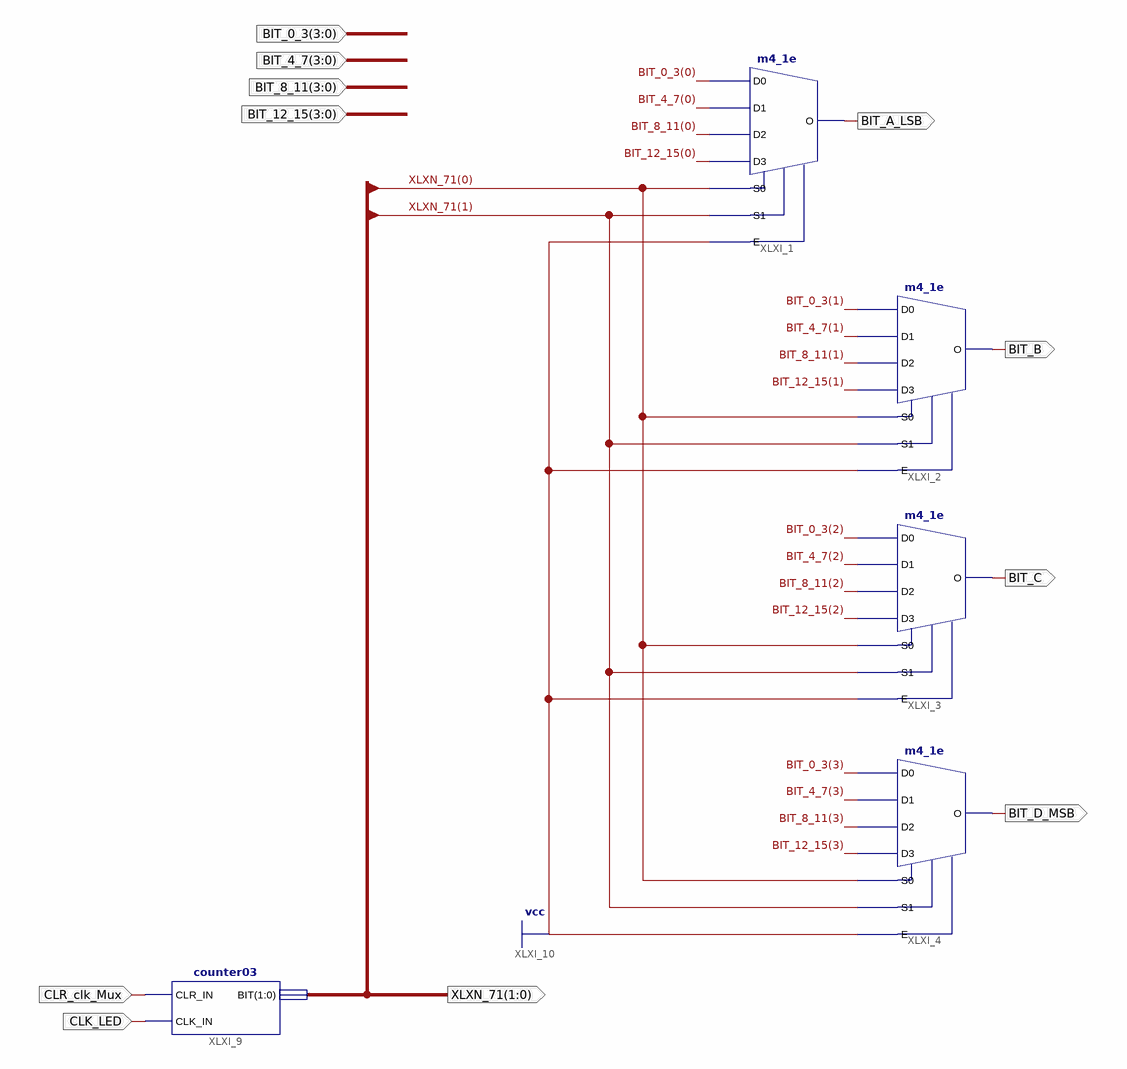
[diagram p0: schematic sheet 1]
// Xilinx ISE schematic Mux4_Swap_LED.sch (spartan6) as structural Verilog: 5 symbols, 11 ports
module Mux4_Swap_LED (
  input  [3:0] BIT_0_3,
  input  [3:0] BIT_4_7,
  input  [3:0] BIT_8_11,
  input  [3:0] BIT_12_15,
  input  CLR_clk_Mux,
  input  CLK_LED,
  output BIT_A_LSB,
  output BIT_D_MSB,
  output BIT_C,
  output BIT_B,
  output [1:0] XLXN_71
);

  m4_1e XLXI_1 (
    .D0(BIT_0_3[0]), .D1(BIT_4_7[0]), .D2(BIT_8_11[0]), .D3(BIT_12_15[0]), .E(1'b1), .S0(XLXN_71[0]),
    .S1(XLXN_71[1]), .O(BIT_A_LSB));
  m4_1e XLXI_2 (
    .D0(BIT_0_3[1]), .D1(BIT_4_7[1]), .D2(BIT_8_11[1]), .D3(BIT_12_15[1]), .E(1'b1), .S0(XLXN_71[0]),
    .S1(XLXN_71[1]), .O(BIT_B));
  m4_1e XLXI_3 (
    .D0(BIT_0_3[2]), .D1(BIT_4_7[2]), .D2(BIT_8_11[2]), .D3(BIT_12_15[2]), .E(1'b1), .S0(XLXN_71[0]),
    .S1(XLXN_71[1]), .O(BIT_C));
  m4_1e XLXI_4 (
    .D0(BIT_0_3[3]), .D1(BIT_4_7[3]), .D2(BIT_8_11[3]), .D3(BIT_12_15[3]), .E(1'b1), .S0(XLXN_71[0]),
    .S1(XLXN_71[1]), .O(BIT_D_MSB));
  counter03 XLXI_9 (.CLR_IN(CLR_clk_Mux), .CLK_IN(CLK_LED), .BIT(XLXN_71));
endmodule
